# Altium schematic sheet SDRAM.SchDoc: Bison-Board
size A4; DrawnBy: mzy2364; Revision: V1.4
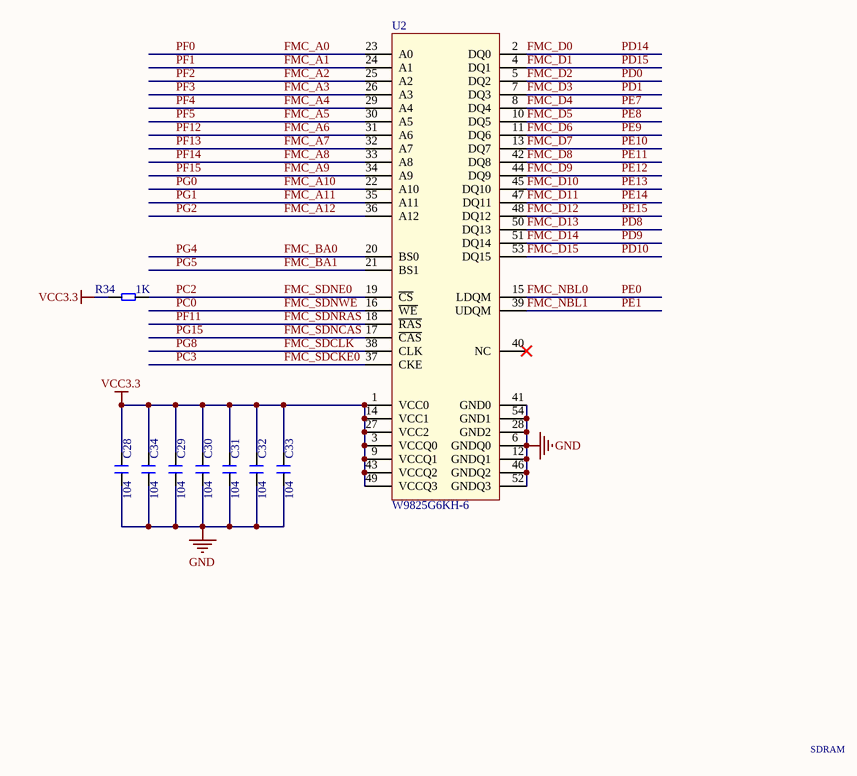
[diagram p0: SDRAM.SchDoc]

## Parts
C28  104  [C 0603]
C29  104  [C 0603]
C30  104  [C 0603]
C31  104  [C 0603]
C32  104  [C 0603]
C33  104  [C 0603]
C34  104  [C 0603]
R34  1K  [R 0603]
U2  W9825G6KH-6  [TSOP54]

## Nets
GND: C28.1 C29.1 C30.1 C31.1 C32.1 C33.1 C34.2 U2.6(GNDQ0) U2.12(GNDQ1) U2.28(GND2) U2.41(GND0) U2.46(GNDQ2) U2.52(GNDQ3) U2.54(GND1)
VCC3.3: C28.2 C29.2 C30.2 C31.2 C32.2 C33.2 C34.1 R34.1 U2.1(VCC0) U2.3(VCCQ0) U2.9(VCCQ1) U2.14(VCC1) U2.27(VCC2) U2.43(VCCQ2) U2.49(VCCQ3)
FMC_A0: U2.23(A0)  [also labelled PF0]
FMC_A1: U2.24(A1)  [also labelled PF1]
FMC_A2: U2.25(A2)  [also labelled PF2]
FMC_A3: U2.26(A3)  [also labelled PF3]
FMC_A4: U2.29(A4)  [also labelled PF4]
FMC_A5: U2.30(A5)  [also labelled PF5]
FMC_A6: U2.31(A6)  [also labelled PF12]
FMC_A7: U2.32(A7)  [also labelled PF13]
FMC_A8: U2.33(A8)  [also labelled PF14]
FMC_A9: U2.34(A9)  [also labelled PF15]
FMC_A10: U2.22(A10)  [also labelled PG0]
FMC_A11: U2.35(A11)  [also labelled PG1]
FMC_A12: U2.36(A12)  [also labelled PG2]
FMC_BA0: U2.20(BS0)  [also labelled PG4]
FMC_BA1: U2.21(BS1)  [also labelled PG5]
FMC_D0: U2.2(DQ0)  [also labelled PD14]
FMC_D1: U2.4(DQ1)  [also labelled PD15]
FMC_D2: U2.5(DQ2)  [also labelled PD0]
FMC_D3: U2.7(DQ3)  [also labelled PD1]
FMC_D4: U2.8(DQ4)  [also labelled PE7]
FMC_D5: U2.10(DQ5)  [also labelled PE8]
FMC_D6: U2.11(DQ6)  [also labelled PE9]
FMC_D7: U2.13(DQ7)  [also labelled PE10]
FMC_D8: U2.42(DQ8)  [also labelled PE11]
FMC_D9: U2.44(DQ9)  [also labelled PE12]
FMC_D10: U2.45(DQ10)  [also labelled PE13]
FMC_D11: U2.47(DQ11)  [also labelled PE14]
FMC_D12: U2.48(DQ12)  [also labelled PE15]
FMC_D13: U2.50(DQ13)  [also labelled PD8]
FMC_D14: U2.51(DQ14)  [also labelled PD9]
FMC_D15: U2.53(DQ15)  [also labelled PD10]
FMC_NBL0: U2.15(LDQM)  [also labelled PE0]
FMC_NBL1: U2.39(UDQM)  [also labelled PE1]
FMC_SDCKE0: U2.37(CKE)  [also labelled PC3]
FMC_SDCLK: U2.38(CLK)  [also labelled PG8]
FMC_SDNCAS: U2.17(~{CAS})  [also labelled PG15]
FMC_SDNE0: R34.2 U2.19(~{CS})  [also labelled PC2]
FMC_SDNRAS: U2.18(~{RAS})  [also labelled PF11]
FMC_SDNWE: U2.16(~{WE})  [also labelled PC0]

Not connected (* = marked no-connect by the designer): U2 40(NC)*

## Notes on the sheet
- SDRAM

## Library data of the parts
C28-C34 = CAP
R34 = RES